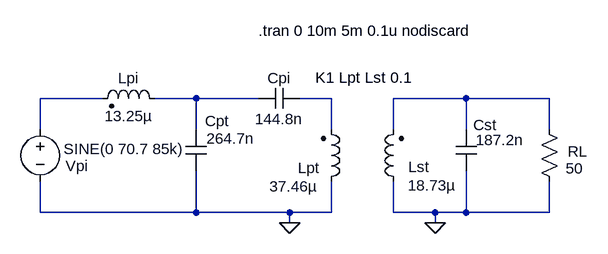
[diagram p0: schematic PPTLCLSPCompM2.asc]
PPTLCLSPCompM2.asc, the LTspice schematic file:
Version 4
SHEET 1 932 680
WIRE -96 240 -192 240
WIRE 48 240 -16 240
WIRE 144 240 48 240
WIRE 256 240 208 240
WIRE 464 240 352 240
WIRE 592 240 464 240
WIRE -192 288 -192 240
WIRE 48 288 48 240
WIRE 256 288 256 240
WIRE 352 288 352 240
WIRE 464 288 464 240
WIRE 592 288 592 240
WIRE -192 416 -192 368
WIRE 48 416 48 352
WIRE 48 416 -192 416
WIRE 192 416 48 416
WIRE 256 416 256 368
WIRE 256 416 192 416
WIRE 352 416 352 368
WIRE 416 416 352 416
WIRE 464 416 464 352
WIRE 464 416 416 416
WIRE 592 416 592 368
WIRE 592 416 464 416
WIRE 192 432 192 416
WIRE 416 432 416 416
FLAG 192 432 0
FLAG 416 432 0
SYMBOL ind2 240 384 M180
WINDOW 0 -35 37 Left 2
WINDOW 3 -79 8 Left 2
SYMATTR InstName Lpt
SYMATTR Value 37.46µ
SYMATTR Type ind
SYMBOL ind2 368 384 R180
WINDOW 0 -39 38 Left 2
WINDOW 3 -80 10 Left 2
SYMATTR InstName Lst
SYMATTR Value 18.73µ
SYMATTR Type ind
SYMATTR SpiceLine Rser=0
SYMBOL res 576 272 R0
WINDOW 0 44 50 Left 2
WINDOW 3 41 76 Left 2
SYMATTR InstName RL
SYMATTR Value 50
SYMBOL cap 480 352 R180
WINDOW 0 -31 71 Left 2
WINDOW 3 -73 48 Left 2
SYMATTR InstName Cst
SYMATTR Value 187.2n
SYMBOL cap 64 352 R180
WINDOW 0 -35 77 Left 2
WINDOW 3 -74 50 Left 2
SYMATTR InstName Cpt
SYMATTR Value 264.7n
SYMBOL voltage -192 272 R0
WINDOW 0 39 72 Left 2
WINDOW 3 36 46 Left 2
SYMATTR InstName Vpi
SYMATTR Value SINE(0 70.7 85k)
SYMBOL ind2 0 256 M270
WINDOW 0 32 56 VTop 2
WINDOW 3 4 56 VBottom 2
SYMATTR InstName Lpi
SYMATTR Value 13.25µ
SYMATTR Type ind
SYMATTR SpiceLine Rser=0.05
SYMBOL cap 144 256 R270
WINDOW 0 32 32 VTop 2
WINDOW 3 0 32 VBottom 2
SYMATTR InstName Cpi
SYMATTR Value 144.8n
TEXT 232 208 Left 2 !K1 Lpt Lst 0.1
TEXT 144 136 Left 2 !.tran 0 10m 5m 0.1u nodiscard

The netlist it stands for:
* PPTLCLSPCompM2.asc
Lpt 0 N003 37.46µ
Lst 0 N004 18.73µ Rser=0
RL N004 0 50
Cst 0 N004 187.2n
Cpt 0 N002 264.7n
Vpi N001 0 SINE(0 70.7 85k)
Lpi N002 N001 13.25µ Rser=0.05
Cpi N002 N003 144.8n
K1 Lpt Lst 0.1
.tran 0 10m 5m 0.1u nodiscard
.backanno
.end